# EAGLE schematic AMS Test Board rev1 (EAGLE 9.6.2)
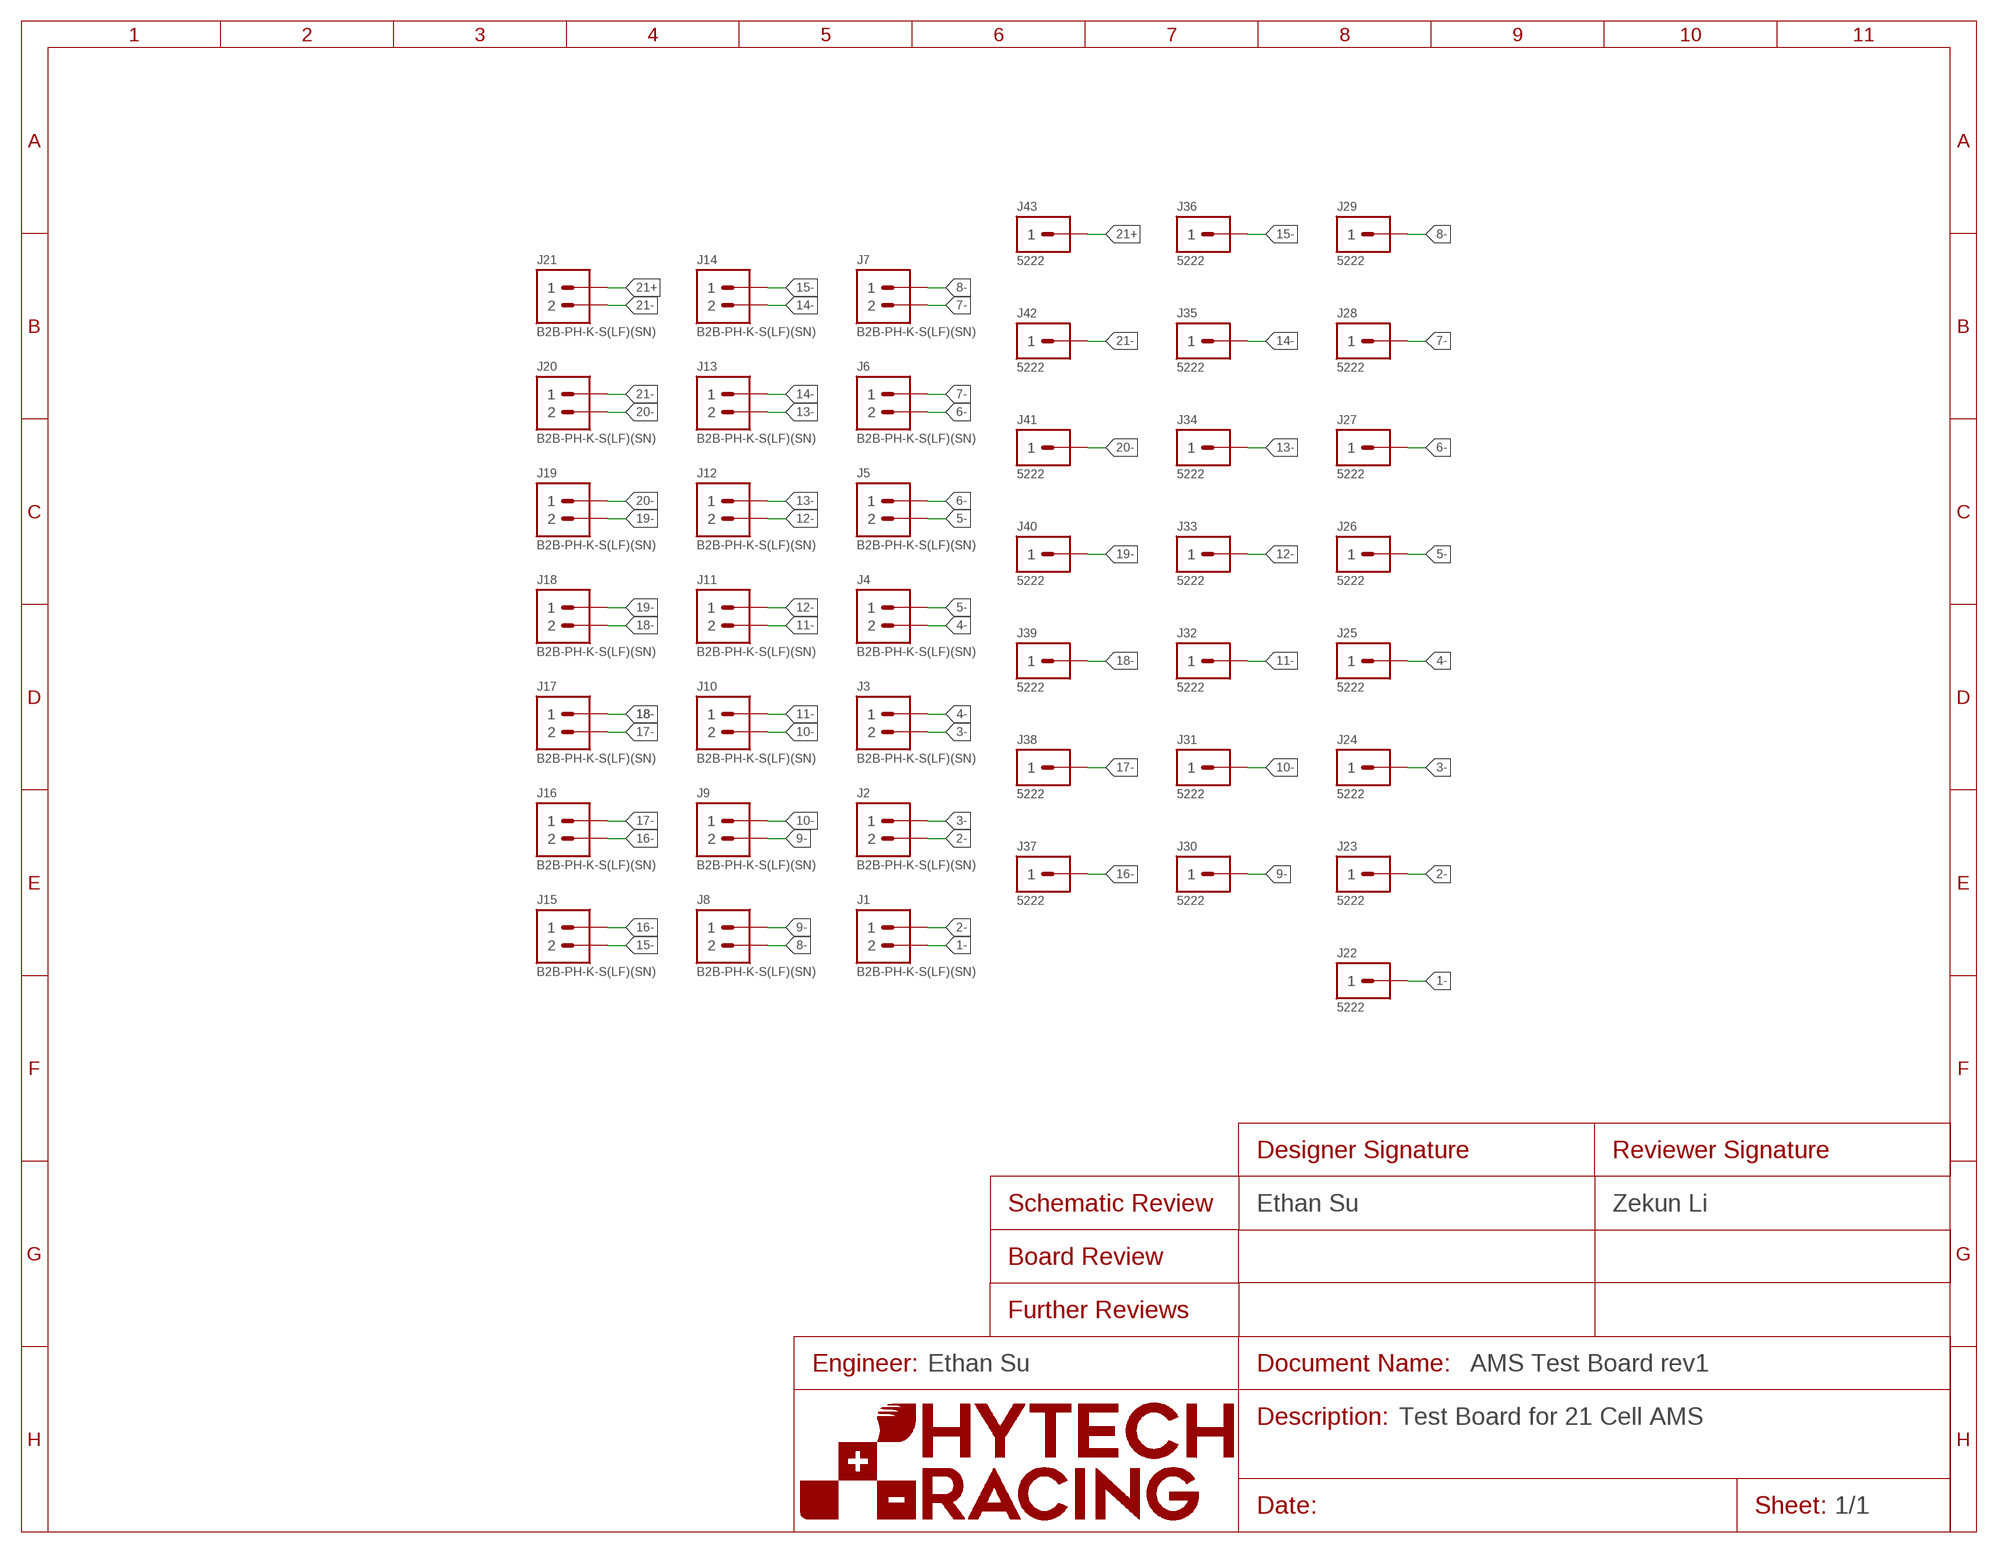
[diagram p0: schematic, sheet 1]
FRAME1 (FRAME): DESCRIPTION_1: Test Board for 21 Cell AMS; DESIGNER_SCHEMATIC: Ethan Su; ENGINEER: Ethan Su; REVIEWER_SCHEMATIC: Zekun Li

## Parts
J1  CONNECTOR-2__B2B-PH-K  [B2B-PH-K]
J2  CONNECTOR-2__B2B-PH-K  [B2B-PH-K]
J3  CONNECTOR-2__B2B-PH-K  [B2B-PH-K]
J4  CONNECTOR-2__B2B-PH-K  [B2B-PH-K]
J5  CONNECTOR-2__B2B-PH-K  [B2B-PH-K]
J6  CONNECTOR-2__B2B-PH-K  [B2B-PH-K]
J7  CONNECTOR-2__B2B-PH-K  [B2B-PH-K]
J8  CONNECTOR-2__B2B-PH-K  [B2B-PH-K]
J9  CONNECTOR-2__B2B-PH-K  [B2B-PH-K]
J10  CONNECTOR-2__B2B-PH-K  [B2B-PH-K]
J11  CONNECTOR-2__B2B-PH-K  [B2B-PH-K]
J12  CONNECTOR-2__B2B-PH-K  [B2B-PH-K]
J13  CONNECTOR-2__B2B-PH-K  [B2B-PH-K]
J14  CONNECTOR-2__B2B-PH-K  [B2B-PH-K]
J15  CONNECTOR-2__B2B-PH-K  [B2B-PH-K]
J16  CONNECTOR-2__B2B-PH-K  [B2B-PH-K]
J17  CONNECTOR-2__B2B-PH-K  [B2B-PH-K]
J18  CONNECTOR-2__B2B-PH-K  [B2B-PH-K]
J19  CONNECTOR-2__B2B-PH-K  [B2B-PH-K]
J20  CONNECTOR-2__B2B-PH-K  [B2B-PH-K]
J21  CONNECTOR-2__B2B-PH-K  [B2B-PH-K]
J22  CONNECTOR-1_5222  [5222]
J23  CONNECTOR-1_5222  [5222]
J24  CONNECTOR-1_5222  [5222]
J25  CONNECTOR-1_5222  [5222]
J26  CONNECTOR-1_5222  [5222]
J27  CONNECTOR-1_5222  [5222]
J28  CONNECTOR-1_5222  [5222]
J29  CONNECTOR-1_5222  [5222]
J30  CONNECTOR-1_5222  [5222]
J31  CONNECTOR-1_5222  [5222]
J32  CONNECTOR-1_5222  [5222]
J33  CONNECTOR-1_5222  [5222]
J34  CONNECTOR-1_5222  [5222]
J35  CONNECTOR-1_5222  [5222]
J36  CONNECTOR-1_5222  [5222]
J37  CONNECTOR-1_5222  [5222]
J38  CONNECTOR-1_5222  [5222]
J39  CONNECTOR-1_5222  [5222]
J40  CONNECTOR-1_5222  [5222]
J41  CONNECTOR-1_5222  [5222]
J42  CONNECTOR-1_5222  [5222]
J43  CONNECTOR-1_5222  [5222]

## Nets
1-: J1.2 J22.1
2-: J1.1 J2.2 J23.1
3-: J2.1 J3.2 J24.1
4-: J3.1 J4.2 J25.1
5-: J4.1 J5.2 J26.1
6-: J5.1 J6.2 J27.1
7-: J6.1 J7.2 J28.1
8-: J7.1 J8.2 J29.1
9-: J8.1 J9.2 J30.1
10-: J9.1 J10.2 J31.1
11-: J10.1 J11.2 J32.1
12-: J11.1 J12.2 J33.1
13-: J12.1 J13.2 J34.1
14-: J13.1 J14.2 J35.1
15-: J14.1 J15.2 J36.1
16-: J15.1 J16.2 J37.1
17-: J16.1 J17.2 J38.1
18-: J17.1 J18.2 J39.1
19-: J18.1 J19.2 J40.1
20-: J19.1 J20.2 J41.1
21+: J21.1 J43.1
21-: J20.1 J21.2 J42.1

## Library data of the parts
J1-J21 = HyTechDevices:CONNECTOR-2_?_*: 2 Pin Connector; DKPN: 455-1704-ND; MANUFACTURER: JST Sales America Inc.; MPN: B2B-PH-K-S(LF)(SN); NWRKPN: 37K9940
J22-J43 = HyTechDevices:CONNECTOR-1_?: 1 Pin Connector Pogo pin datasheet <https://www.mouser.com/datasheet/2/273/Mill-Max_03212019_807-22-001-10-020101-1545127.pdf> 5222 Spring datasheet <https://www.mouser.com/datasheet/2/215/5222-743174.pdf>; DKPN: 36-5222-ND; MANUFACTURER: Keystone Electronics; MODEL: SPRING; MOPN: 534-5222; MPN: 5222